# Altium schematic sheet Sheet1.SchDoc
size A4
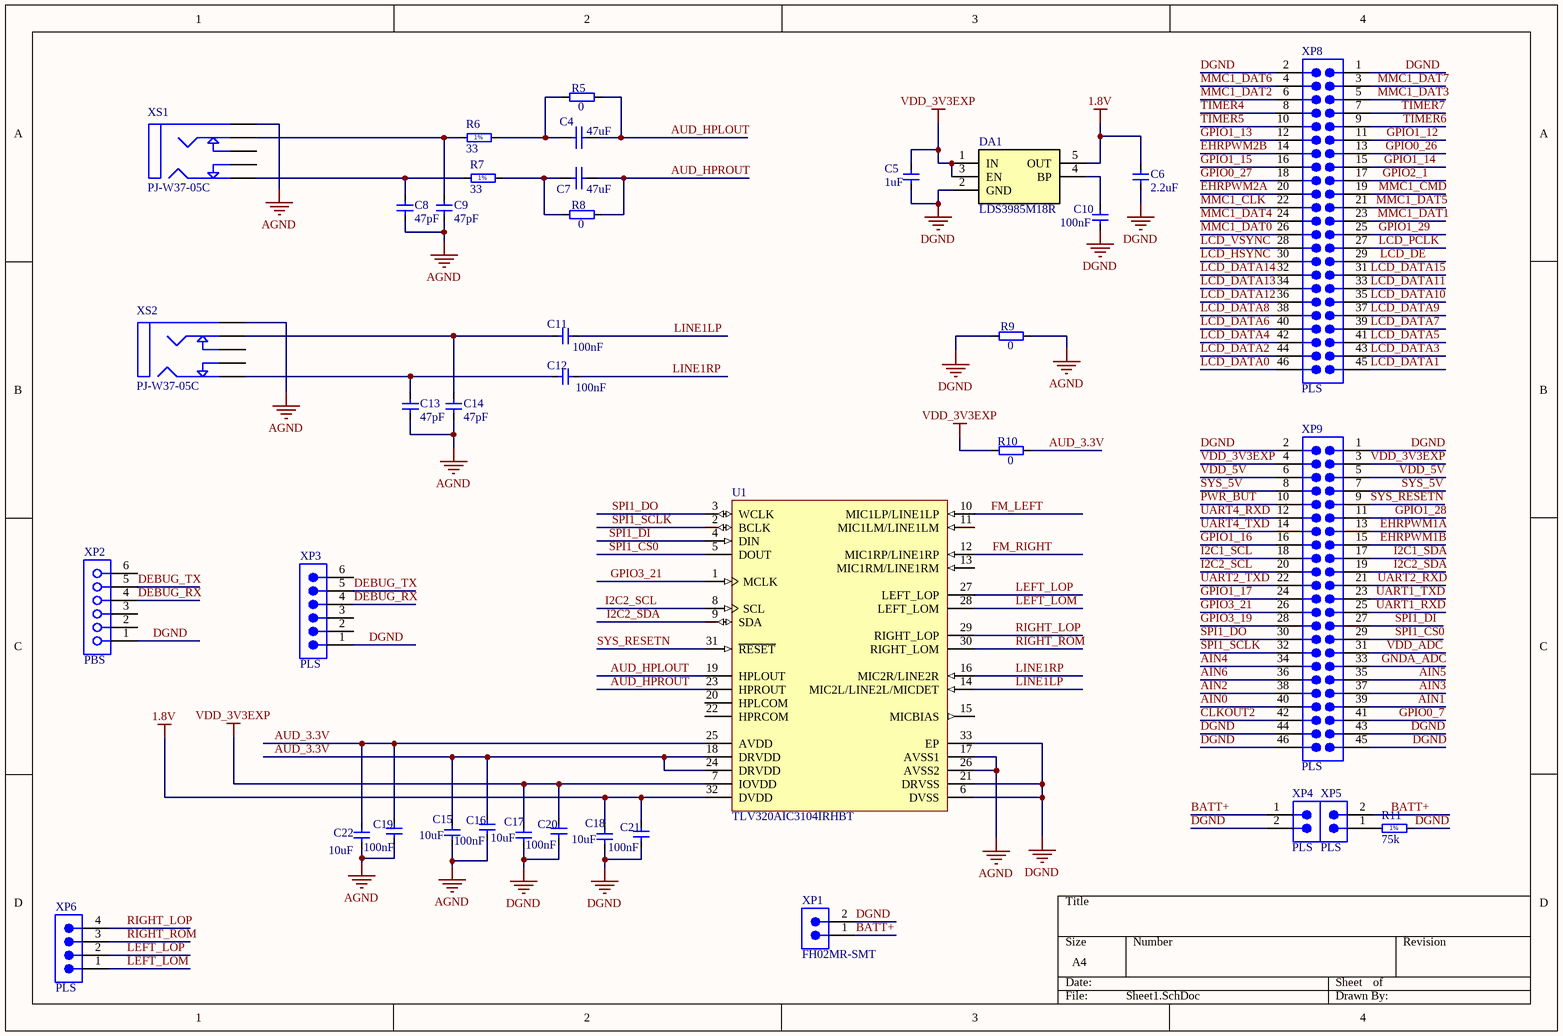
[diagram p0: Sheet1.SchDoc]

## Parts
C4  47uF  [CAPC2012X140N]
C5  1uF  [CAP0603R]
C6  2.2uF  [CAP0603R]
C7  47uF  [CAPC2012X140N]
C8  47pF  [CAP0603R]
C9  47pF  [CAP0603R]
C10  100nF  [CAP0603R]
C11  100nF  [CAP0603R]
C12  100nF  [CAP0603R]
C13  47pF  [CAP0603R]
C14  47pF  [CAP0603R]
C15  10uF  [CAP0603R]
C16  100nF  [CAP0603R]
C17  10uF  [CAP0603R]
C18  10uF  [CAP0603R]
C19  100nF  [CAP0603R]
C20  100nF  [CAP0603R]
C21  100nF  [CAP0603R]
C22  10uF  [CAP0603R]
DA1  LDS3985M18R  [SOT23-5]
R5  0  [RESC1608X55N]
R6  33  [RES0603R]
R7  33  [RES0603R]
R8  0  [RESC1608X55N]
R9  0  [RESC1608X55N]
R10  0  [RESC1608X55N]
R11  75k  [RES0603R]
U1  TLV320AIC3104IRHBT  [RHB32-3450X3450TP]
XP1  FH02MR-SMT  [FH02MR-SMT]
XP2  PBS  [PBS-06]
XP3  PLS  [PLS-06]
XP4  PLS  [PLS-02]
XP5  PLS  [PLS-02]
XP6  PLS  [PLS-04]
XP8  PLS  [PLD-46]
XP9  PLS  [PLD-46]
XS1  PJ-W37-05C  [PJ-W37-05C]
XS2  PJ-W37-05C  [PJ-W37-05C]

## Nets
1.8V: C6.2 C18.2 C21.1 DA1.5(OUT) U1.32(DVDD)
AGND: C8.2 C9.2 C13.2 C14.2 C15.1 C16.2 C19.2 C22.1 R9.2 U1.17(AVSS1) U1.26(AVSS2) XS1.1 XS2.1
DGND: C5.2 C6.1 C10.1 C17.1 C18.1 C20.2 C21.2 DA1.2(GND) R9.1 R11.2 U1.6(DVSS) U1.21(DRVSS) U1.33(EP) XP1.2 XP2.1 XP3.1 XP4.2 XP8.1 XP8.2 XP9.1 XP9.2 XP9.43 XP9.44 XP9.45 XP9.46
VDD_3V3EXP: C5.1 C17.2 C20.1 DA1.1(IN) DA1.3(EN) R10.1 U1.7(IOVDD) XP9.3 XP9.4
AIN0: XP9.40
AIN1: XP9.39
AIN2: XP9.38
AIN3: XP9.37
AIN4: XP9.34
AIN5: XP9.35
AIN6: XP9.36
AUD_3.3V: C15.2 C16.1 C19.1 C22.2 R10.2 U1.18(DRVDD) U1.24(DRVDD) U1.25(AVDD)
AUD_HPLOUT: C4.2 R5.2 U1.19(HPLOUT)
AUD_HPROUT: C7.2 R8.2 U1.23(HPROUT)
BATT+: XP1.1 XP4.1 XP5.2
CLKOUT2: XP9.42
DEBUG_RX: XP2.4 XP3.4
DEBUG_TX: XP2.5 XP3.5
EHRPWM1A: XP9.13
EHRPWM1B: XP9.15
EHRPWM2A: XP8.20
EHRPWM2B: XP8.14
FM_LEFT: U1.10(MIC1LP/LINE1LP)
FM_RIGHT: U1.12(MIC1RP/LINE1RP)
GNDA_ADC: XP9.33
GPIO0_7: XP9.41
GPIO0_26: XP8.13
GPIO0_27: XP8.18
GPIO1_12: XP8.11
GPIO1_13: XP8.12
GPIO1_14: XP8.15
GPIO1_15: XP8.16
GPIO1_16: XP9.16
GPIO1_17: XP9.24
GPIO1_28: XP9.11
GPIO1_29: XP8.25
GPIO2_1: XP8.17
GPIO3_19: XP9.28
GPIO3_21: U1.1(MCLK) XP9.26
I2C1_SCL: XP9.18
I2C1_SDA: XP9.17
I2C2_SCL: U1.8(SCL) XP9.20
I2C2_SDA: U1.9(SDA) XP9.19
LCD_DATA0: XP8.46
LCD_DATA1: XP8.45
LCD_DATA2: XP8.44
LCD_DATA3: XP8.43
LCD_DATA4: XP8.42
LCD_DATA5: XP8.41
LCD_DATA6: XP8.40
LCD_DATA7: XP8.39
LCD_DATA8: XP8.38
LCD_DATA9: XP8.37
LCD_DATA10: XP8.35
LCD_DATA11: XP8.33
LCD_DATA12: XP8.36
LCD_DATA13: XP8.34
LCD_DATA14: XP8.32
LCD_DATA15: XP8.31
LCD_DE: XP8.29
LCD_HSYNC: XP8.30
LCD_PCLK: XP8.27
LCD_VSYNC: XP8.28
LEFT_LOM: U1.28(LEFT_LOM) XP6.1
LEFT_LOP: U1.27(LEFT_LOP) XP6.2
LINE1LP: C11.2 U1.14(MIC2L/LINE2L/MICDET)
LINE1RP: C12.2 U1.16(MIC2R/LINE2R)
MMC1_CLK: XP8.22
MMC1_CMD: XP8.19
MMC1_DAT0: XP8.26
MMC1_DAT1: XP8.23
MMC1_DAT2: XP8.6
MMC1_DAT3: XP8.5
MMC1_DAT4: XP8.24
MMC1_DAT5: XP8.21
MMC1_DAT6: XP8.4
MMC1_DAT7: XP8.3
PWR_BUT: XP9.10
RIGHT_LOP: U1.29(RIGHT_LOP) XP6.4
RIGHT_ROM: U1.30(RIGHT_LOM) XP6.3
SPI1_CS0: U1.5(DOUT) XP9.29
SPI1_DI: U1.4(DIN) XP9.27
SPI1_DO: U1.3(WCLK) XP9.30
SPI1_SCLK: U1.2(BCLK) XP9.32
SYS_5V: XP9.7 XP9.8
SYS_RESETN: U1.31(~{RESET}) XP9.9
TIMER4: XP8.8
TIMER5: XP8.10
TIMER6: XP8.9
TIMER7: XP8.7
UART1_RXD: XP9.25
UART1_TXD: XP9.23
UART2_RXD: XP9.21
UART2_TXD: XP9.22
UART4_RXD: XP9.12
UART4_TXD: XP9.14
VDD_5V: XP9.5 XP9.6
VDD_ADC: XP9.31
NetC4_1: C4.1 R5.1 R6.2
NetC7_1: C7.1 R7.2 R8.1
NetC8_1: C8.1 R7.1 XS1.3
NetC9_1: C9.1 R6.1 XS1.2
NetC10_2: C10.2 DA1.4(BP)
NetC11_1: C11.1 C14.1 XS2.2
NetC12_1: C12.1 C13.1 XS2.3
NetR11_1: R11.1 XP5.1

Not connected (* = marked no-connect by the designer): U1 11(MIC1LM/LINE1LM) 13(MIC1RM/LINE1RM) 15(MICBIAS) 20(HPLCOM) 22(HPRCOM); XP2 2 3 6; XP3 2 3 6; XS1 4 5; XS2 4 5

## Notes on the sheet
- (in symbol R0603_33R_1%_0.1W_100PPM) 1%
- (in symbol R0603_75K_1%_0.1W_100PPM) 1%

## Library data of the parts
C4 C7 = CC0805_47UF_6.3V_20%_X5R: Non-polarised capacitor; Part Description: SMD Multilayer Chip Ceramic Capacitor; Manufacturer: GENERIC; Manufacturer1 Part Number: C0805C476M9PACTU; Voltage: 6.3V; TC: X5R; Tolerance: ±20%; Table: Capacitors SMD; Part Number: CC0805_47UF_6.3V_20%_X5R; Component Kind: Standard; Component Type: Standard; Pin Count: 2; Value: 47uF; Status: Preferred; Manufacturer Part Number: CC0805_47UF_6.3V_20%_X5R; Case: 0805; Mounted: Yes; Socket: No; SMD: Yes; Manufacturer1 Example: KEMET; Manufacturer1 ComponentHeight: 1.4mm; HelpURL: \\cern.ch\dfs\Applications\Altium\Datasheets\CC0805_X5R_KEMET.pdf; Author: CERN DEM JLC; CreateDate: 16.10.2012; LatestRevisionDate: 16.10.2012
C5 = CC0603_1UF_16V_10%_X7R: SMD 0805 Capacitor; Part Description: SMD Multilayer Chip Ceramic Capacitor; Manufacturer: GENERIC; Manufacturer1 Part Number: 223824613663; Voltage: 16V; TC: X7R; Tolerance: ±10%; Table: Capacitors SMD; Part Number: CC0603_1UF_16V_10%_X7R; Component Kind: Standard; Component Type: Standard; Pin Count: 2; Value: 1uF; Status: Preferred; Manufacturer Part Number: CC0603_1uF_16V_10%_X7R; Case: 0603; Mounted: Yes; Socket: No; SMD: Yes; Manufacturer1 Example: PHYCOMP; Manufacturer1 ComponentHeight: 0.87mm; HelpURL: \\cern.ch\dfs\Applications\Altium\Datasheets\CC0805_X5R_PHYCOMP_HC.pdf; Author: I. Kuznetsov; CreateDate: 03.12.2007; LatestRevisionDate: 03.12.2007
C6 = CC0603_2.2UF_6.3V_10%_X5R: SMD 0805 Capacitor; Part Description: SMD Multilayer Chip Ceramic Capacitor; Manufacturer: GENERIC; Manufacturer1 Part Number: 225520613667; Voltage: 6.3V; TC: X5R; Tolerance: ±10%; Table: Capacitors SMD; Part Number: CC0603_2.2UF_6.3V_10%_X5R; Component Kind: Standard; Component Type: Standard; Pin Count: 2; Value: 2.2uF; Status: Preferred; Manufacturer Part Number: CC0603_2.2uF_6.3V_10%_X5R; Case: 0603; Mounted: Yes; Socket: No; SMD: Yes; Manufacturer1 Example: PHYCOMP; Manufacturer1 ComponentHeight: 0.87mm; HelpURL: \\cern.ch\dfs\Applications\Altium\Datasheets\CC0805_X5R_PHYCOMP_HC.pdf; Author: I. Kuznetsov; CreateDate: 03.12.2007; LatestRevisionDate: 03.12.2007
C8 C9 C13 C14 = CC0603_47PF_50V_5%_NP0: SMD 0805 Capacitor; Part Description: SMD Multilayer Chip Ceramic Capacitor; Manufacturer: GENERIC; Manufacturer1 Part Number: 223886715479; Voltage: 50V; TC: NP0; Tolerance: ±5%; Table: Capacitors SMD; Part Number: CC0603_47PF_50V_5%_NP0; Component Kind: Standard; Component Type: Standard; Pin Count: 2; Value: 47pF; Status: Preferred; Manufacturer Part Number: CC0603_47PF_50V_5%_NP0; Case: 0603; Mounted: Yes; Socket: No; SMD: Yes; Manufacturer1 Example: PHYCOMP; Manufacturer1 ComponentHeight: 0.87mm; HelpURL: \\cern.ch\dfs\Applications\Altium\Datasheets\CC0603_NP0_PHYCOMP.pdf; Author: I. Kuznetsov; CreateDate: 03.12.2007; LatestRevisionDate: 03.12.2007
C10-C12 C16 C19-C21 = CC0603_100NF_50V_10%_X7R: SMD 0805 Capacitor; Part Description: SMD Multilayer Chip Ceramic Capacitor; Manufacturer: GENERIC; Manufacturer1 Part Number: 223858615649; Voltage: 50V; TC: X7R; Tolerance: ±10%; Table: Capacitors SMD; Part Number: CC0603_100NF_50V_10%_X7R; Component Kind: Standard; Component Type: Standard; Pin Count: 2; Value: 100nF; Status: Preferred; Manufacturer Part Number: CC0603_100NF_50V_10%_X7R; Case: 0603; Mounted: Yes; Socket: No; SMD: Yes; Manufacturer1 Example: PHYCOMP; Manufacturer1 ComponentHeight: 0.87mm; HelpURL: \\cern.ch\dfs\Applications\Altium\Datasheets\CC0603_X7R_PHYCOMP.pdf; Author: I. Kuznetsov; CreateDate: 03.12.2007; LatestRevisionDate: 03.12.2007
C15 C17 C18 C22 = CC0603_10UF_6.3V_20%_X5R: SMD 0805 Capacitor; Part Description: SMD Multilayer Chip Ceramic Capacitor; Manufacturer: GENERIC; Manufacturer1 Part Number: C0603C106M9PAC; Voltage: 6.3V; TC: X5R; Tolerance: ±20%; Table: Capacitors SMD; Part Number: CC0603_10UF_6.3V_20%_X5R; Component Kind: Standard; Component Type: Standard; Pin Count: 2; Value: 10uF; Status: Preferred; Manufacturer Part Number: CC0603_10uF_6.3V_20%_X5R; Case: 0603; Mounted: Yes; Socket: No; SMD: Yes; Manufacturer1 Example: KEMET; Manufacturer1 ComponentHeight: 0.95mm; HelpURL: \\cern.ch\dfs\Applications\Altium\Datasheets\CC0603_X5R_KEMET.pdf; Author: I. Kuznetsov; CreateDate: 03.12.2007; LatestRevisionDate: 03.12.2007
DA1 = LDS3985M18R: Manufacturer: ST; Table: Regulators; Part Number: LDS3985M18R; Component Kind: Standard; Component Type: Standard; Device: LDS3985M18R; Status: Active; Manufacturer Part Number: LDS3985M18R; Pin Count: 5; Case: SOT23-5; Mounted: Yes; Socket: No; SMD: Yes; Author: I. Kuznetsov
R5 R8-R10 = R0603_0R_JUMPER: Resistor; Part Description: 1A (0.05R Max DC Resistance) Zero Ohm Jumper; Manufacturer: GENERIC; Manufacturer1 Part Number: NRC06Z0; Table: Resistors SMD; Part Number: R0603_0R_JUMPER; Component Kind: Standard; Component Type: Standard; Pin Count: 2; Value: 0; Status: Preferred; Manufacturer Part Number: R0603_0R_JUMPER; Case: 0603; Mounted: Yes; Socket: No; SMD: Yes; Manufacturer1 Example: NIC COMPONENT; Manufacturer1 ComponentHeight: 0.55mm; HelpURL: \\cern.ch\dfs\Applications\Altium\Datasheets\R0603_NIC_NRC.pdf; Author: CERN DEM JLC; CreateDate: 03.12.2007; LatestRevisionDate: 13.03.2008
R6 R7 = R0603_33R_1%_0.1W_100PPM: Part Description: General Purpose Thick Film Chip Resistor; Manufacturer: GENERIC; Manufacturer1 Part Number: NRC06F33R0TRF; Power: 0.1W; TC: ±100ppm/°C; Tolerance: ±1%; Table: Resistors SMD; Part Number: R0603_33R_1%_0.1W_100PPM; Component Kind: Standard; Component Type: Standard; Footprint: RESC1608X55N; Pin Count: 2; Value: 33; Status: Preferred; Manufacturer Part Number: R0603_33R_1%_0.1W_100PPM; Case: 0603; Mounted: Yes; Socket: No; SMD: Yes; Manufacturer1 Example: NIC COMPONENT; Manufacturer1 ComponentHeight: 0.55mm; HelpURL: \\cern.ch\dfs\Applications\Altium\Datasheets\R0603_NIC_NRC.pdf; Author: CERN DEM JLC; CreateDate: 03.12.2007; LatestRevisionDate: 13.03.2008
R11 = R0603_75K_1%_0.1W_100PPM: Part Description: General Purpose Thick Film Chip Resistor; Manufacturer: GENERIC; Manufacturer1 Part Number: NRC06F7502TRF; Power: 0.1W; TC: ±100ppm/°C; Tolerance: ±1%; Table: Resistors SMD; Part Number: R0603_75K_1%_0.1W_100PPM; Component Kind: Standard; Component Type: Standard; Footprint: RESC1608X55N; Pin Count: 2; Value: 75k; Status: Preferred; Manufacturer Part Number: R0603_75K_1%_0.1W_100PPM; Case: 0603; Mounted: Yes; Socket: No; SMD: Yes; Manufacturer1 Example: NIC COMPONENT; Manufacturer1 ComponentHeight: 0.55mm; HelpURL: \\cern.ch\dfs\Applications\Altium\Datasheets\R0603_NIC_NRC.pdf; Author: CERN DEM JLC; CreateDate: 03.12.2007; LatestRevisionDate: 13.03.2008
U1 = CMP-0331-00065-1: Low-Power Stereo CODEC with 6 Inputs, 6 Outputs, HP Amp and Enhanced Digital Effects, 2 ADCs and 2 DACs, 102 dB DAC SNR, -40 to 85 degC, 32-pin QFN (RHB), Green (RoHS & no Sb/Br); Manufacturer: Texas Instruments; Digital Audio Interfaces: L, R, I2S, DSP, TDM; Additional Features: LP Bypass, Notch Filtering, 3D, EQ, Matrix Mixing, PLL; Sampling Rate (Max) (kHz): 96; # ADCs (typ): 2; Battery Powered: TRUE; DAC SNR: 102; Control Interface: I2C; PartNumber: TLV320AIC3104IRHBT; Code_JEDEC: MO-220; ComponentLink1Description: Datasheet; Mounting Technology: Surface Mount; PackageVersion: revD, Jun-2011; DatasheetVersion: SLAS510C; PackageReference: RHB32-3450X3450TP; PackageDescription: 32-Pin Plastic Quad Flat No-Lead, 5 x 5 mm Body, 0.5 mm Pitch, 3.45 x 3.45 mm Exposed Pad; # DACs: 2; ComponentLink1URL: http://www.ti.com/general/docs/lit/getliterature.tsp?genericPartNumber=TLV320AIC3104&fileType=pdf
XP1 = FH02MR-SMT: Table: OTHER; Part Number: FH02MR-SMT; Family: FH02MR-SMT; Device: FH02MR-SMT
XP2 = PBS-06: Table: AUK; Part Number: PBS-06; Component Kind: Standard; Component Type: Standard; PackageDescription: PBS-06; Pin Count: 6; Family: PBS; SMD: No; Device: PBS-06
XP3 = PLS-06: Manufacturer: AUK; Part Number: PLS-06; Component Kind: Standard; Component Type: Standard; PackageDescription: PLS-06; Pin Count: 6; Family: PLS; SMD: Yes; Device: PLS-06; Manufacturer Part Number: PLS-06; Table: AUK
XP4 XP5 = PLS-02: Manufacturer: AUK; Part Number: PLS-02; Component Kind: Standard; Component Type: Standard; PackageDescription: PLS-02; Pin Count: 2; Family: PLS; SMD: No; Device: PLS-02; Manufacturer Part Number: PLS-02; Table: AUK
XP6 = PLS-04: Manufacturer: AUK; Part Number: PLS-04; Component Kind: Standard; Component Type: Standard; PackageDescription: PLS-04; Pin Count: 4; Family: PLS; SMD: No; Device: PLS-04; Manufacturer Part Number: PLS-04; Table: AUK
XP8 XP9 = PLD-46: Manufacturer: AUK; Manufacturer Part Number: PLS-16; Part Number: PLD-46; Component Kind: Standard; Component Type: Standard; PackageDescription: PLS-16; Pin Count: 16; Family: PLS; SMD: No; Device: PLD-46; Table: AUK
XS1 XS2 = PJ-W37-05C: 3.5 mm Jack Connector; Table: AUK; Part Number: PJ-W37-05C; Family: PJ; Device: PJ-W37-05C